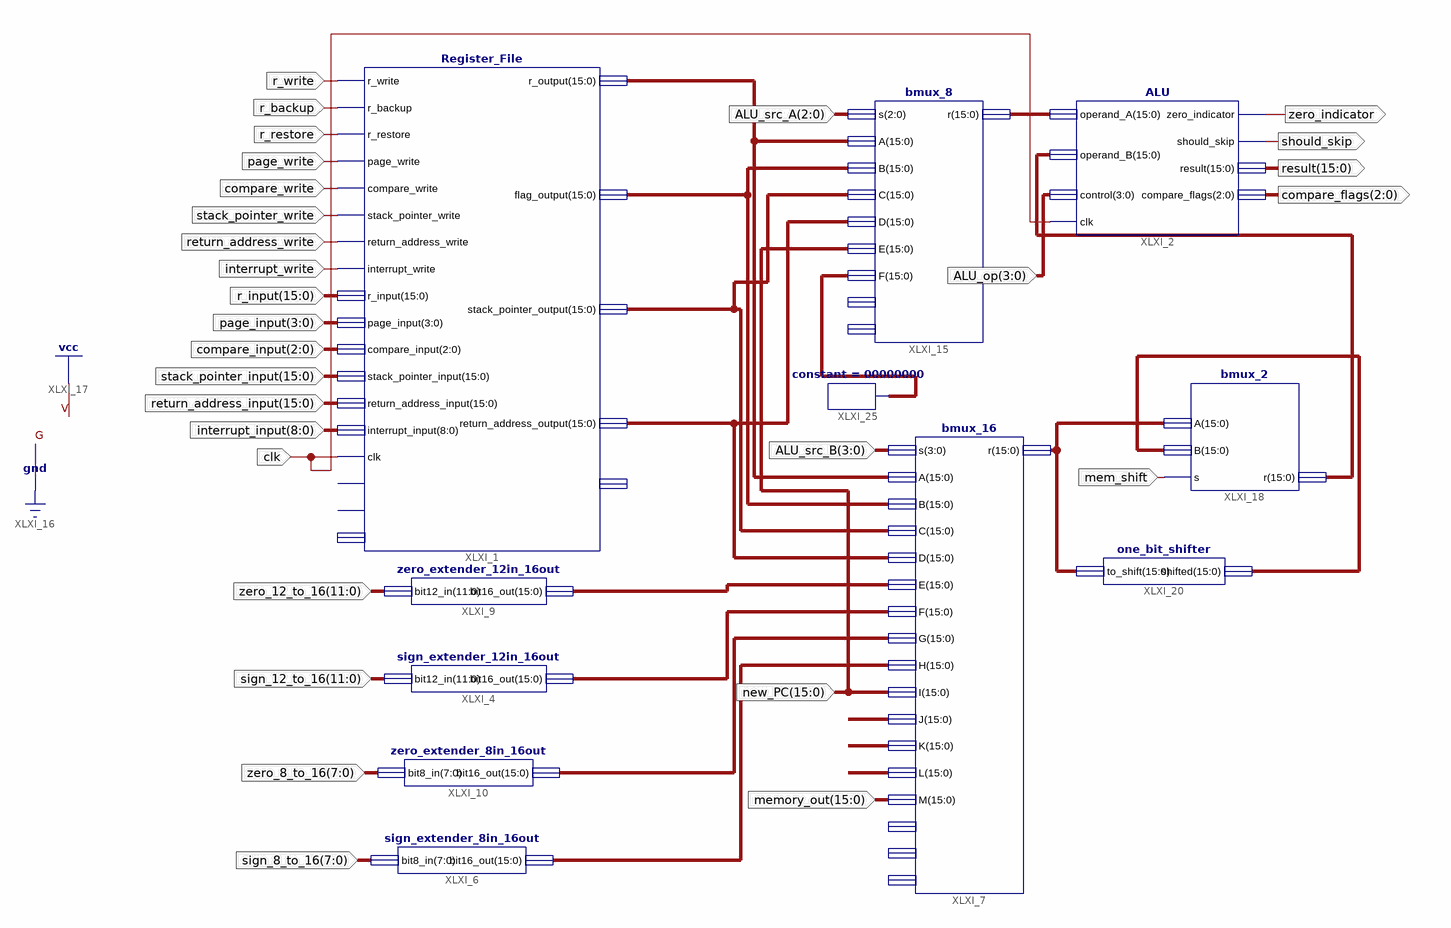
[diagram p0: schematic sheet 1]
// Xilinx ISE schematic Datapath_ALU_Fragment.sch (spartan3e) as structural Verilog: 11 symbols, 29 ports
module Datapath_ALU_Fragment (
  input  r_write,
  input  r_backup,
  input  r_restore,
  input  page_write,
  input  compare_write,
  input  stack_pointer_write,
  input  return_address_write,
  input  interrupt_write,
  input  [15:0] r_input,
  input  [3:0] page_input,
  input  [2:0] compare_input,
  input  [15:0] stack_pointer_input,
  input  [15:0] return_address_input,
  input  [8:0] interrupt_input,
  input  [3:0] ALU_src_B,
  input  [15:0] new_PC,
  input  [15:0] memory_out,
  input  [2:0] ALU_src_A,
  input  [11:0] zero_12_to_16,
  input  [11:0] sign_12_to_16,
  input  [7:0] zero_8_to_16,
  input  [7:0] sign_8_to_16,
  input  mem_shift,
  input  [3:0] ALU_op,
  input  clk,
  output zero_indicator,
  output should_skip,
  output [15:0] result,
  output [2:0] compare_flags
);

  wire [15:0] XLXN_3, XLXN_4, XLXN_5, XLXN_6, XLXN_7, XLXN_8, XLXN_9, XLXN_11, XLXN_43, XLXN_57, XLXN_63,
       XLXN_64, XLXN_71;

  Register_File XLXI_1 (
    .r_write(r_write), .r_backup(r_backup), .r_restore(r_restore), .page_write(page_write),
    .compare_write(compare_write), .stack_pointer_write(stack_pointer_write),
    .return_address_write(return_address_write), .interrupt_write(interrupt_write), .clk(clk),
    .r_input(r_input), .page_input(page_input), .compare_input(compare_input),
    .stack_pointer_input(stack_pointer_input), .return_address_input(return_address_input),
    .interrupt_input(interrupt_input), .r_output(XLXN_3), .flag_output(XLXN_4),
    .stack_pointer_output(XLXN_5), .return_address_output(XLXN_6));  // open: r_inport, r_outport, inport, outport
  ALU XLXI_2 (
    .operand_A(XLXN_43), .operand_B(XLXN_57), .control(ALU_op), .zero_indicator(zero_indicator),
    .should_skip(should_skip), .result(result), .compare_flags(compare_flags), .clk(clk));
  sign_extender_12in_16out XLXI_4 (.bit12_in(sign_12_to_16), .bit16_out(XLXN_8));
  sign_extender_8in_16out XLXI_6 (.bit8_in(sign_8_to_16), .bit16_out(XLXN_11));
  bmux_16 XLXI_7 (
    .s(ALU_src_B), .A(XLXN_3), .B(XLXN_4), .C(XLXN_5), .D(XLXN_6), .E(XLXN_7), .F(XLXN_8), .G(XLXN_9),
    .H(XLXN_11), .I(new_PC), .J(16'b0000000000000001), .K({16{1'b0}}), .L({16{1'b1}}), .M(memory_out),
    .r(XLXN_63));  // open: N, O, P
  zero_extender_12in_16out XLXI_9 (.bit12_in(zero_12_to_16), .bit16_out(XLXN_7));
  zero_extender_8in_16out XLXI_10 (.bit8_in(zero_8_to_16), .bit16_out(XLXN_9));
  bmux_8 XLXI_15 (
    .s(ALU_src_A), .A(XLXN_3), .B(XLXN_4), .C(XLXN_5), .D(XLXN_6), .E(new_PC), .F(XLXN_71), .r(XLXN_43));  // open: G, H
  bmux_2 XLXI_18 (.A(XLXN_63), .B(XLXN_64), .s(mem_shift), .r(XLXN_57));
  one_bit_shifter XLXI_20 (.to_shift(XLXN_63), .shifted(XLXN_64));
  constant #(.CValue("00000000")) XLXI_25 (.O(XLXN_71));
endmodule
